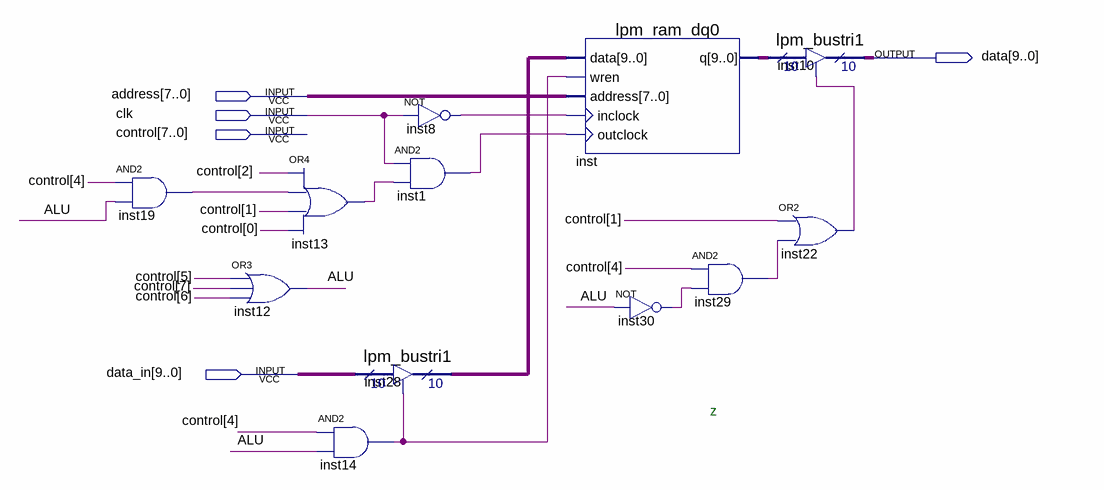
[diagram p0: schematic sheet]
// Quartus schematic RAM.bdf as structural Verilog: 12 symbols, 5 pins
module RAM (
  input  [7:0] address,
  input  clk,
  input  [7:0] control,
  input  [9:0] data_in,
  output [9:0] data
);

  wire ALU, inst1_out, inst8_out, inst13_out, inst14_out, inst19_out, inst22_out, inst29_out, inst30_out;
  wire [9:0] inst28_tridata, inst_q;

  and inst19 (inst19_out, control[4], ALU);
  or inst12 (ALU, control[5], control[7], control[6]);
  or inst13 (inst13_out, control[2], inst19_out, control[1], control[0]);
  and inst14 (inst14_out, control[4], ALU);
  not inst8 (inst8_out, clk);
  and inst1 (inst1_out, clk, inst13_out);
  lpm_bustri1 inst28 (.enabledt(inst14_out), .data(data_in), .tridata(inst28_tridata));
  lpm_ram_dq0 inst (
    .data(inst28_tridata), .wren(inst14_out), .address(address), .inclock(inst8_out), .outclock(inst1_out),
    .q(inst_q));
  not inst30 (inst30_out, ALU);
  and inst29 (inst29_out, control[4], inst30_out);
  lpm_bustri1 inst10 (.enabledt(inst22_out), .data(inst_q), .tridata(data));
  or inst22 (inst22_out, control[1], inst29_out);

  // Notes on the sheet:
  //   z
endmodule
